# EAGLE design FlashMob (EAGLE 8.4.2)
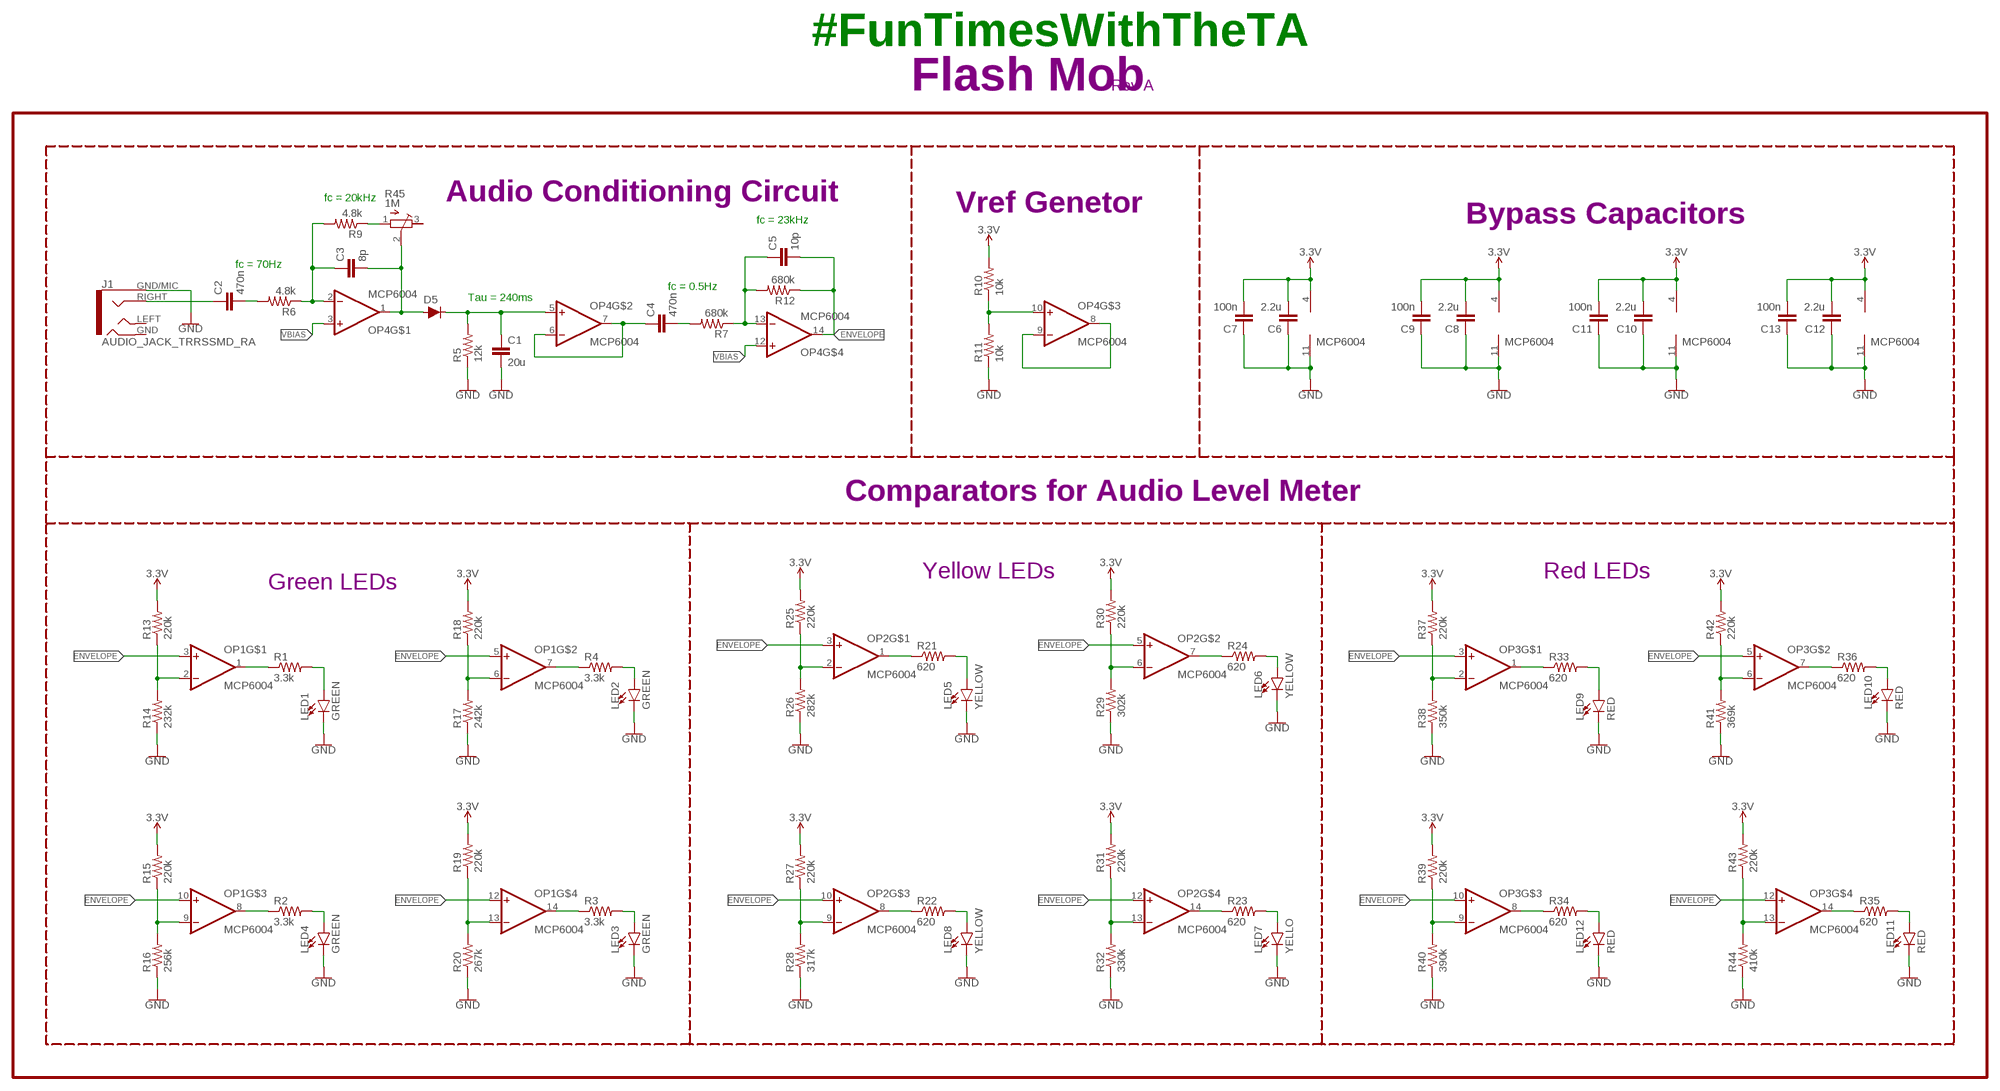
[diagram p0: schematic, sheet 1]

## Parts
C1  20u  CAPACITOR0402  [C0402]
C2  470n  CAPACITOR0402  [C0402]
C3  8p  CAPACITOR0402  [C0402]
C4  470n  CAPACITOR0402  [C0402]
C5  10p  CAPACITOR0402  [C0402]
C6  2.2u  CAPACITOR0402  [C0402]
C7  100n  CAPACITOR0402  [C0402]
C8  2.2u  CAPACITOR0402  [C0402]
C9  100n  CAPACITOR0402  [C0402]
C10  2.2u  CAPACITOR0402  [C0402]
C11  100n  CAPACITOR0402  [C0402]
C12  2.2u  CAPACITOR0402  [C0402]
C13  100n  CAPACITOR0402  [C0402]
D5  DIODE-BAS16J  [SOD-323]
J1  AUDIO_JACK_TRRSSMD_RA  [AUDIO_JACK_3.5MM_TRRS_SMD_RA]
LED1  GREEN  LED0603  [LED-0603]
LED2  GREEN  LED0603  [LED-0603]
LED3  GREEN  LED0603  [LED-0603]
LED4  GREEN  LED0603  [LED-0603]
LED5  YELLOW  LED0603  [LED-0603]
LED6  YELLOW  LED0603  [LED-0603]
LED7  YELLO  LED0603  [LED-0603]
LED8  YELLOW  LED0603  [LED-0603]
LED9  RED  LED0603  [LED-0603]
LED10  RED  LED0603  [LED-0603]
LED11  RED  LED0603  [LED-0603]
LED12  RED  LED0603  [LED-0603]
OP1  MCP6004  OP-QUAD-TSSOP14  [TSSOP14]
OP2  MCP6004  OP-QUAD-TSSOP14  [TSSOP14]
OP3  MCP6004  OP-QUAD-TSSOP14  [TSSOP14]
OP4  MCP6004  OP-QUAD-TSSOP14  [TSSOP14]
R1  3.3k  RESISTOR0402  [R0402]
R2  3.3k  RESISTOR0402  [R0402]
R3  3.3k  RESISTOR0402  [R0402]
R4  3.3k  RESISTOR0402  [R0402]
R5  12k  RESISTOR0402  [R0402]
R6  4.8k  RESISTOR0402  [R0402]
R7  680k  RESISTOR0402  [R0402]
R9  4.8k  RESISTOR0402  [R0402]
R10  10k  RESISTOR0402  [R0402]
R11  10k  RESISTOR0402  [R0402]
R12  680k  RESISTOR0402  [R0402]
R13  220k  RESISTOR0402  [R0402]
R14  232k  RESISTOR0402  [R0402]
R15  220k  RESISTOR0402  [R0402]
R16  256k  RESISTOR0402  [R0402]
R17  242k  RESISTOR0402  [R0402]
R18  220k  RESISTOR0402  [R0402]
R19  220k  RESISTOR0402  [R0402]
R20  267k  RESISTOR0402  [R0402]
R21  620  RESISTOR0402  [R0402]
R22  620  RESISTOR0402  [R0402]
R23  620  RESISTOR0402  [R0402]
R24  620  RESISTOR0402  [R0402]
R25  220k  RESISTOR0402  [R0402]
R26  282k  RESISTOR0402  [R0402]
R27  220k  RESISTOR0402  [R0402]
R28  317k  RESISTOR0402  [R0402]
R29  302k  RESISTOR0402  [R0402]
R30  220k  RESISTOR0402  [R0402]
R31  220k  RESISTOR0402  [R0402]
R32  330k  RESISTOR0402  [R0402]
R33  620  RESISTOR0402  [R0402]
R34  620  RESISTOR0402  [R0402]
R35  620  RESISTOR0402  [R0402]
R36  620  RESISTOR0402  [R0402]
R37  220k  RESISTOR0402  [R0402]
R38  350k  RESISTOR0402  [R0402]
R39  220k  RESISTOR0402  [R0402]
R40  390k  RESISTOR0402  [R0402]
R41  369k  RESISTOR0402  [R0402]
R42  220k  RESISTOR0402  [R0402]
R43  220k  RESISTOR0402  [R0402]
R44  410k  RESISTOR0402  [R0402]
R45  1M  TRIM-POT-P160  [16MMROTARYPOT]
U$1  REVISION.A  [REV.A]

## Nets
3.3V: C6.2 C7.2 C8.2 C9.2 C10.2 C11.2 C12.2 C13.2 OP1.4(V+) OP2.4(V+) OP3.4(V+) OP4.4(V+) R10.2 R13.2 R15.2 R18.2 R19.2 R25.2 R27.2 R30.2 R31.2 R37.2 R39.2 R42.2 R43.2
ENVELOPE: C5.2 OP1.3(+IN) OP1.5(+IN) OP1.10(+IN) OP1.12(+IN) OP2.3(+IN) OP2.5(+IN) OP2.10(+IN) OP2.12(+IN) OP3.3(+IN) OP3.5(+IN) OP3.10(+IN) OP3.12(+IN) OP4.14(OUT) R12.1
GND: C1.2 C6.1 C7.1 C8.1 C9.1 C10.1 C11.1 C12.1 C13.1 J1.GND/MIC(SLEEVE) LED1.C LED2.C LED3.C LED4.C LED5.C LED6.C LED7.C LED8.C LED9.C LED10.C LED11.C LED12.C OP1.11(V-) OP2.11(V-) OP3.11(V-) OP4.11(V-) R5.1 R11.1 R14.1 R16.1 R17.1 R20.1 R26.1 R28.1 R29.1 R32.1 R38.1 R40.1 R41.1 R44.1
N$1: OP1.1(OUT) R1.1
N$2: OP1.8(OUT) R2.1
N$3: OP1.14(OUT) R3.1
N$4: OP1.7(OUT) R4.1
N$5: C2.2 R6.2
N$6: C4.1 OP4.6(-IN) OP4.7(OUT)
N$7: LED1.A R1.2
N$8: LED4.A R2.2
N$9: LED3.A R3.2
N$10: LED2.A R4.2
N$11: C3.1 OP4.2(-IN) R6.1 R9.2
N$12: R9.1 R45.1(A)
N$13: C5.1 OP4.13(-IN) R7.1 R12.2
N$14: C3.2 D5.A OP4.1(OUT) R45.2(S)
N$15: OP4.10(+IN) R10.1 R11.2
N$16: OP4.8(OUT) OP4.9(-IN)
N$17: C4.2 R7.2
N$18: C2.1 J1.RIGHT(RING1)
N$19: C1.1 D5.C OP4.5(+IN) R5.2
N$20: OP1.2(-IN) R13.1 R14.2
N$21: OP1.9(-IN) R15.1 R16.2
N$22: OP1.6(-IN) R17.2 R18.1
N$23: OP1.13(-IN) R19.1 R20.2
N$24: OP2.1(OUT) R21.1
N$25: OP2.8(OUT) R22.1
N$26: OP2.14(OUT) R23.1
N$27: OP2.7(OUT) R24.1
N$28: LED5.A R21.2
N$29: LED8.A R22.2
N$30: LED7.A R23.2
N$31: LED6.A R24.2
N$32: OP2.2(-IN) R25.1 R26.2
N$33: OP2.9(-IN) R27.1 R28.2
N$34: OP2.6(-IN) R29.2 R30.1
N$35: OP2.13(-IN) R31.1 R32.2
N$36: OP3.1(OUT) R33.1
N$37: OP3.8(OUT) R34.1
N$38: OP3.14(OUT) R35.1
N$39: OP3.7(OUT) R36.1
N$40: LED9.A R33.2
N$41: LED12.A R34.2
N$42: LED11.A R35.2
N$43: LED10.A R36.2
N$44: OP3.2(-IN) R37.1 R38.2
N$45: OP3.9(-IN) R39.1 R40.2
N$46: OP3.6(-IN) R41.2 R42.1
N$47: OP3.13(-IN) R43.1 R44.2
VBIAS: OP4.3(+IN) OP4.12(+IN)
Unconnected: J1.GND(RING2) J1.LEFT(TIP) R45.3(E)

## Notes on the sheet
- #FunTimesWithTheTA
- Flash Mob
- fc = 20kHz | Audio Conditioning Circuit
- Vref Genetor
- fc = 23kHz | Bypass Capacitors
- fc = 70Hz
- fc = 0.5Hz
- Tau = 240ms
- Comparators for Audio Level Meter
- Yellow LEDs | Red LEDs
- Green LEDs

## Library data of the parts
C1-C13 = CalvEngIO-Passives:CAPACITOR
D5 = CalvEngIO-DiscreteSemi:DIODE: Diode These are standard reverse protection diodes and small signal diodes. SparkFun Products: SparkFun SparkPunk Sound Kit <https://www.sparkfun.com/products/11177> SparkFun ESP8266 Thing <https://www.sparkfun.com/products/13231>; PROD_ID: DIO-09646
J1 = CalvEngIO-Connectors:AUDIO_JACK_TRRS: Audio Jack - 3.5mm TRRS (SMD) This is a 3.5mm TRRS SMD audio jack. TRRS connectors are the audio-style connectors that you see on some phones, MP3 players and development boards. TRRS stands for “tip, ring, ring, sleeve,” which reflects that this has three conductors and a ground. SparkFun Products: Audio Jack <https://www.sparkfun.com/products/12639> mbed Starter Kit <https://www.sparkfun.com/products/12968> SparkFun TRRS 3.5mm Jack Breakout <https://www.sparkfun.com/products/11570>; PROD_ID: CONN-10676; SF_ID: PRT-12639
LED1-LED12 = CalvEngIO-LED:LED: LED (Generic) Standard schematic elements and footprints for 5mm, 3mm, 1206, and 0603 sized LEDs. Generic LEDs with no color specified. LTST-C190KGKT: arrow indicates cathode
OP1-OP4 = CalvEngIO-AnalogIC:OP-QUAD: General symbol and footprints for Quad Op Amps. Use with any standard general purpose op amp.
R1-R7 R9-R44 = CalvEngIO-Passives:RESISTOR
R45 = CalvEngIO-Passives:TRIM-POT-P160
U$1 = CalvEngIO-Logos:REVISION.A

## Board
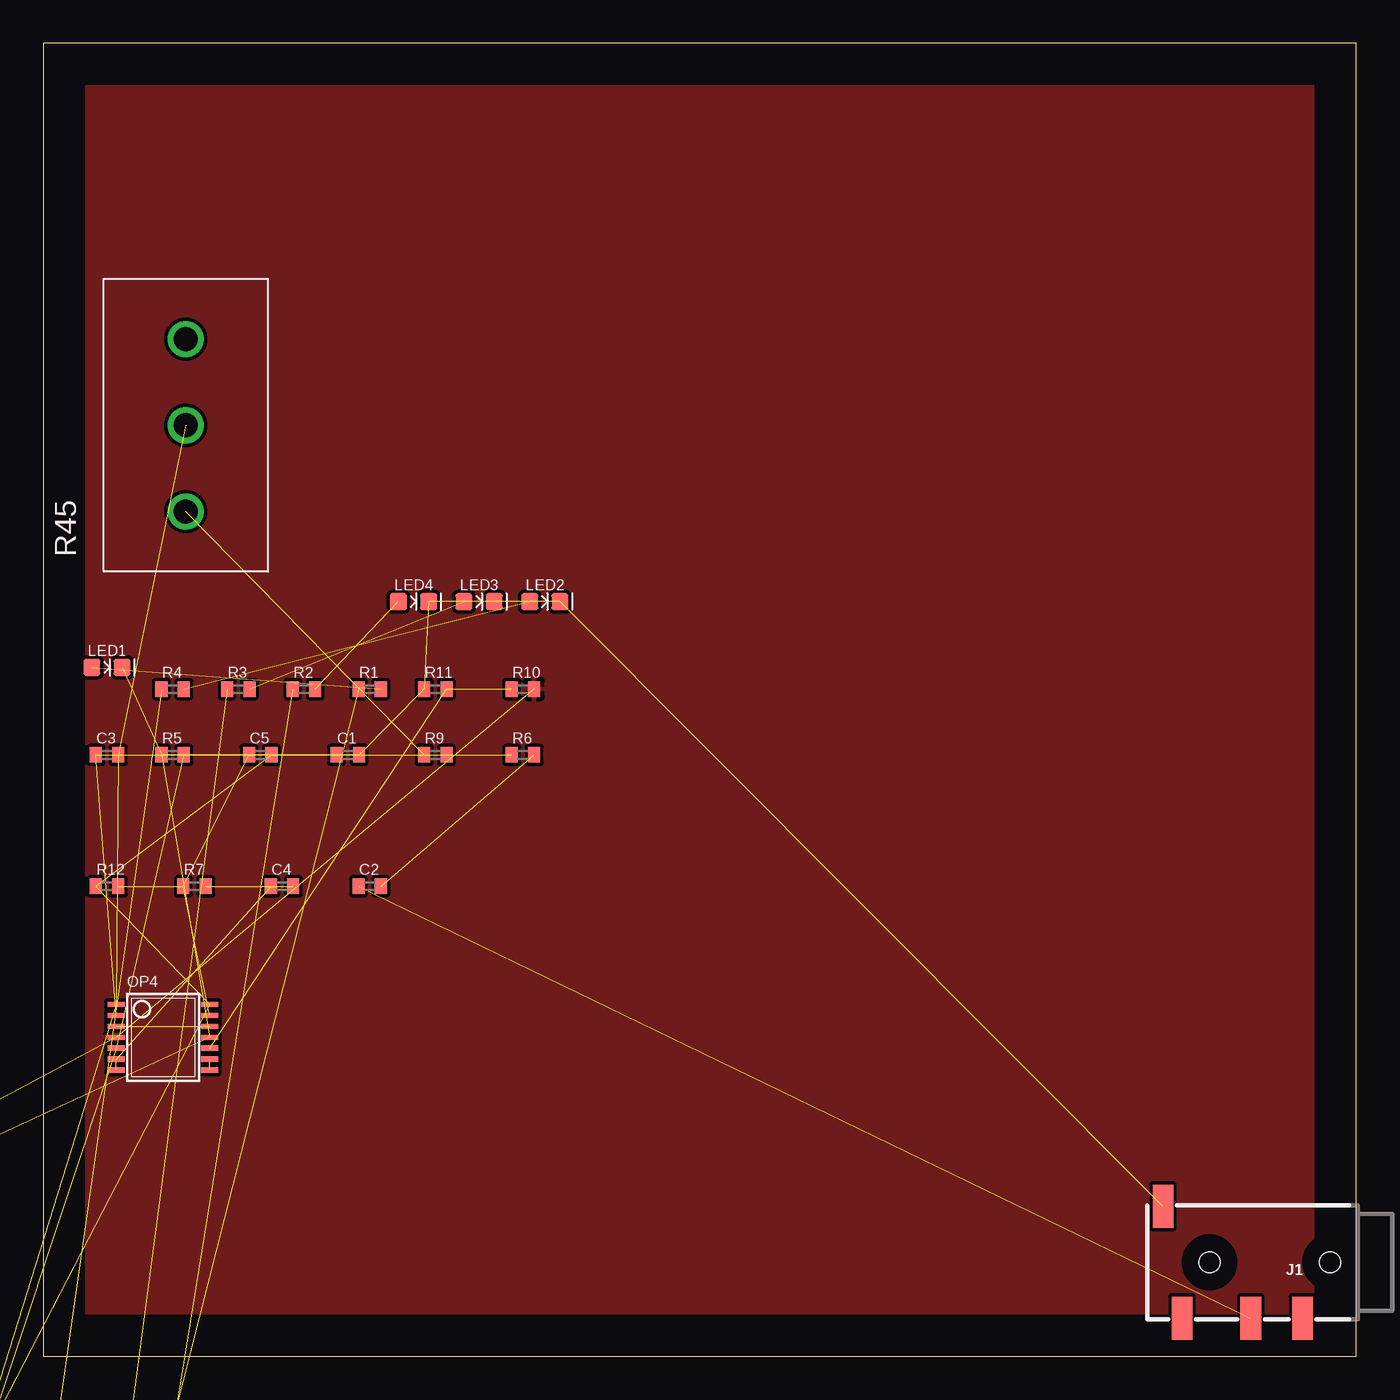
[diagram p1: board, top side]
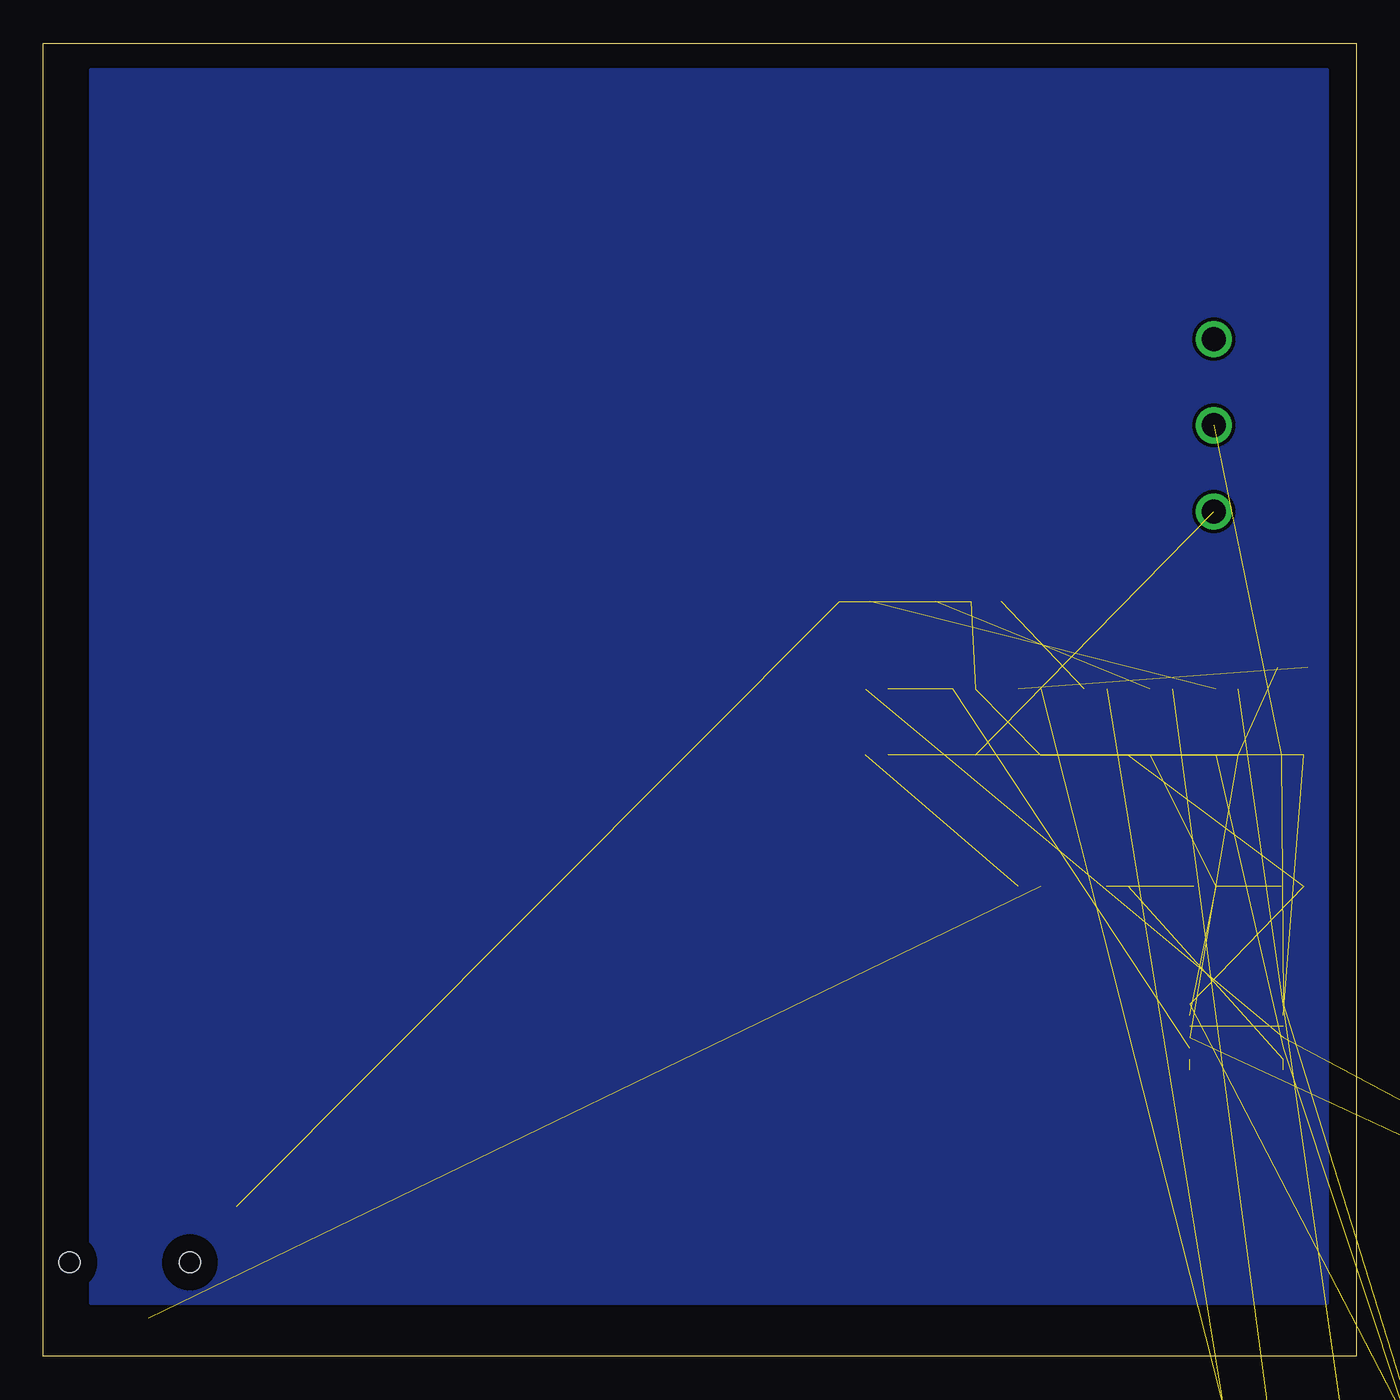
[diagram p2: board, bottom side, seen from below]

Size 76.2 x 76.2 mm. Coordinates in mm from the lower left corner, seen from the top.
Outline: 0,0 76.2,0 76.2,76.2 0,76.2 0,0
Copper layers (1*16): Top 0.035mm / dielectric 1.5mm / Bottom 0.035mm
Design rules "default": minimum track width 10mil, minimum drill 24mil, track to track 8mil, track to pad 8mil, pad to pad 8mil, via to via 8mil, smd to smd 8mil, copper to edge 40mil, drill to drill 8mil, minimum pad ring 10mil, minimum via ring 8mil, stop-mask expansion 4mil, vias tented up to drill 0mil, thermal gap 10mil

### Footprints (pad centres in the part's own frame; a part is rotated, then mirrored left to right if it is on the bottom)
C0402 = smd 0.7 x 0.9: 1 -0.65,0; 2 0.65,0
SOD-323 = smd 0.63 x 0.83: A 1.15,0; C -1.15,0
AUDIO_JACK_3.5MM_TRRS_SMD_RA = smd 1.2 x 2.5: GND 3.2,3.25; GND/MIC 11.3,-3.25; LEFT 10.2,3.25; RIGHT 6.2,3.25 | hole 1.2: 1.6,0; 8.6,0
LED-0603 = smd 1 x 1: A -0.877,0; C 0.877,0
TSSOP14 = smd 0.305 x 0.991: 1 -1.905,-2.718; 2 -1.27,-2.718; 3 -0.635,-2.718; 4 0,-2.718; 5 0.635,-2.718; 6 1.27,-2.718; 7 1.905,-2.718; 8 1.905,2.718; 9 1.27,2.718; 10 0.635,2.718; 11 0,2.718; 12 -0.635,2.718; 13 -1.27,2.718; 14 -1.905,2.718
R0402 = smd 0.7 x 0.9: 1 -0.65,0; 2 0.65,0
16MMROTARYPOT = drill 1.4: 1 -5,0; 2 0,0; 3 5,0

### Placement (x,y rotation side)
C1  17.68,34.9 0 top
C2  18.95,27.28 0 top
C3  3.71,34.9 0 top
C4  13.87,27.28 0 top
C5  12.6,34.9 0 top
C6  -40.64,-5.08 0 top  (outside the outline)
C7  -40.64,-10.16 0 top  (outside the outline)
C8  -14.2,-70.99 0 top  (outside the outline)
C9  -11.46,-70.64 0 top  (outside the outline)
C10  -38.13,-55.65 0 top  (outside the outline)
C11  -38.2,-57.15 0 top  (outside the outline)
C12  -12.7,-89.94 0 top  (outside the outline)
C13  -15.16,-89.89 90 top  (outside the outline)
D5  -40.51,-120.19 0 top  (outside the outline)
J1  76.28,5.46 180 top
LED1  3.71,39.98 0 top
LED2  29.11,43.79 0 top
LED3  25.3,43.79 0 top
LED4  21.49,43.79 0 top
LED5  -40.64,-88.9 0 top  (outside the outline)
LED6  -36.83,-88.9 0 top  (outside the outline)
LED7  -33.02,-88.9 0 top  (outside the outline)
LED8  -29.21,-88.9 0 top  (outside the outline)
LED9  -40.64,-116.84 0 top  (outside the outline)
LED10  -36.83,-116.84 0 top  (outside the outline)
LED11  -33.02,-116.84 0 top  (outside the outline)
LED12  -29.21,-116.84 0 top  (outside the outline)
OP1  -6.27,-70.59 270 top  (outside the outline)
OP2  -32.49,-56.29 270 top  (outside the outline)
OP3  -6.96,-89.64 270 top  (outside the outline)
OP4  6.96,18.52 270 top
R1  18.95,38.71 0 top
R2  15.14,38.71 0 top
R3  11.33,38.71 0 top
R4  7.52,38.71 0 top
R5  7.52,34.9 0 top
R6  27.84,34.9 0 top
R7  8.79,27.28 0 top
R9  22.76,34.9 0 top
R10  27.84,38.71 0 top
R11  22.76,38.71 0 top
R12  3.71,27.28 0 top
R13  -10.72,-68.71 90 top  (outside the outline)
R14  -12.95,-68.68 270 top  (outside the outline)
R15  -1.73,-72.49 270 top  (outside the outline)
R16  0.94,-72.57 90 top  (outside the outline)
R17  -11.07,-72.49 90 top  (outside the outline)
R18  -13.79,-72.49 270 top  (outside the outline)
R19  -1.14,-68.68 90 top  (outside the outline)
R20  0.91,-68.76 270 top  (outside the outline)
R21  -40.64,-80.01 0 top  (outside the outline)
R22  -35.56,-80.01 0 top  (outside the outline)
R23  -30.48,-80.01 0 top  (outside the outline)
R24  -25.4,-80.01 0 top  (outside the outline)
R25  -36.42,-53.16 90 top  (outside the outline)
R26  -39.17,-53.09 270 top  (outside the outline)
R27  -27.43,-58.24 270 top  (outside the outline)
R28  -24.66,-58.24 90 top  (outside the outline)
R29  -38.43,-59.51 90 top  (outside the outline)
R30  -37.03,-59.44 270 top  (outside the outline)
R31  -27.46,-54.36 90 top  (outside the outline)
R32  -25.3,-54.46 270 top  (outside the outline)
R33  -40.64,-107.95 0 top  (outside the outline)
R34  -35.56,-107.95 0 top  (outside the outline)
R35  -30.48,-107.95 0 top  (outside the outline)
R36  -25.4,-107.95 0 top  (outside the outline)
R37  -11.66,-87.73 90 top  (outside the outline)
R38  -13.46,-87.71 270 top  (outside the outline)
R39  -2.16,-91.57 270 top  (outside the outline)
R40  0.33,-91.67 90 top  (outside the outline)
R41  -13.64,-91.85 90 top  (outside the outline)
R42  -11.71,-91.72 270 top  (outside the outline)
R43  -2.26,-87.6 90 top  (outside the outline)
R44  -0.41,-87.6 270 top  (outside the outline)
R45  8.28,54.03 90 top
U$1  -42.14,-122.48 0 top  (outside the outline)

### Tracks (layer width: path | path; a pad name or v marks a point on that pad's centre or on a via)
3.3V  (24 unrouted)
  pour Top: 73.66,73.66 73.66,2.54 2.54,2.54 2.54,73.66
ENVELOPE  (14 unrouted)
GND  (39 unrouted)
  pour Bottom: 1.8,74.65 73.43,74.65 73.43,3.07 1.7,3.07 1.7,74.65
N$1  (1 unrouted)
N$2  (1 unrouted)
N$3  (1 unrouted)
N$4  (1 unrouted)
N$5  (1 unrouted)
N$6  (2 unrouted)
N$7  (1 unrouted)
N$8  (1 unrouted)
N$9  (1 unrouted)
N$10  (1 unrouted)
N$11  (3 unrouted)
N$12  (1 unrouted)
N$13  (3 unrouted)
N$14  (3 unrouted)
N$15  (2 unrouted)
N$16  (1 unrouted)
N$17  (1 unrouted)
N$18  (1 unrouted)
N$19  (3 unrouted)
N$20  (2 unrouted)
N$21  (2 unrouted)
N$22  (2 unrouted)
N$23  (2 unrouted)
N$24  (1 unrouted)
N$25  (1 unrouted)
N$26  (1 unrouted)
N$27  (1 unrouted)
N$28  (1 unrouted)
N$29  (1 unrouted)
N$30  (1 unrouted)
N$31  (1 unrouted)
N$32  (2 unrouted)
N$33  (2 unrouted)
N$34  (2 unrouted)
N$35  (2 unrouted)
N$36  (1 unrouted)
N$37  (1 unrouted)
N$38  (1 unrouted)
N$39  (1 unrouted)
N$40  (1 unrouted)
N$41  (1 unrouted)
N$42  (1 unrouted)
N$43  (1 unrouted)
N$44  (2 unrouted)
N$45  (2 unrouted)
N$46  (2 unrouted)
N$47  (2 unrouted)
VBIAS  (1 unrouted)